# Altium schematic sheet Power_Sheet.SchDoc (part 3 of 3)
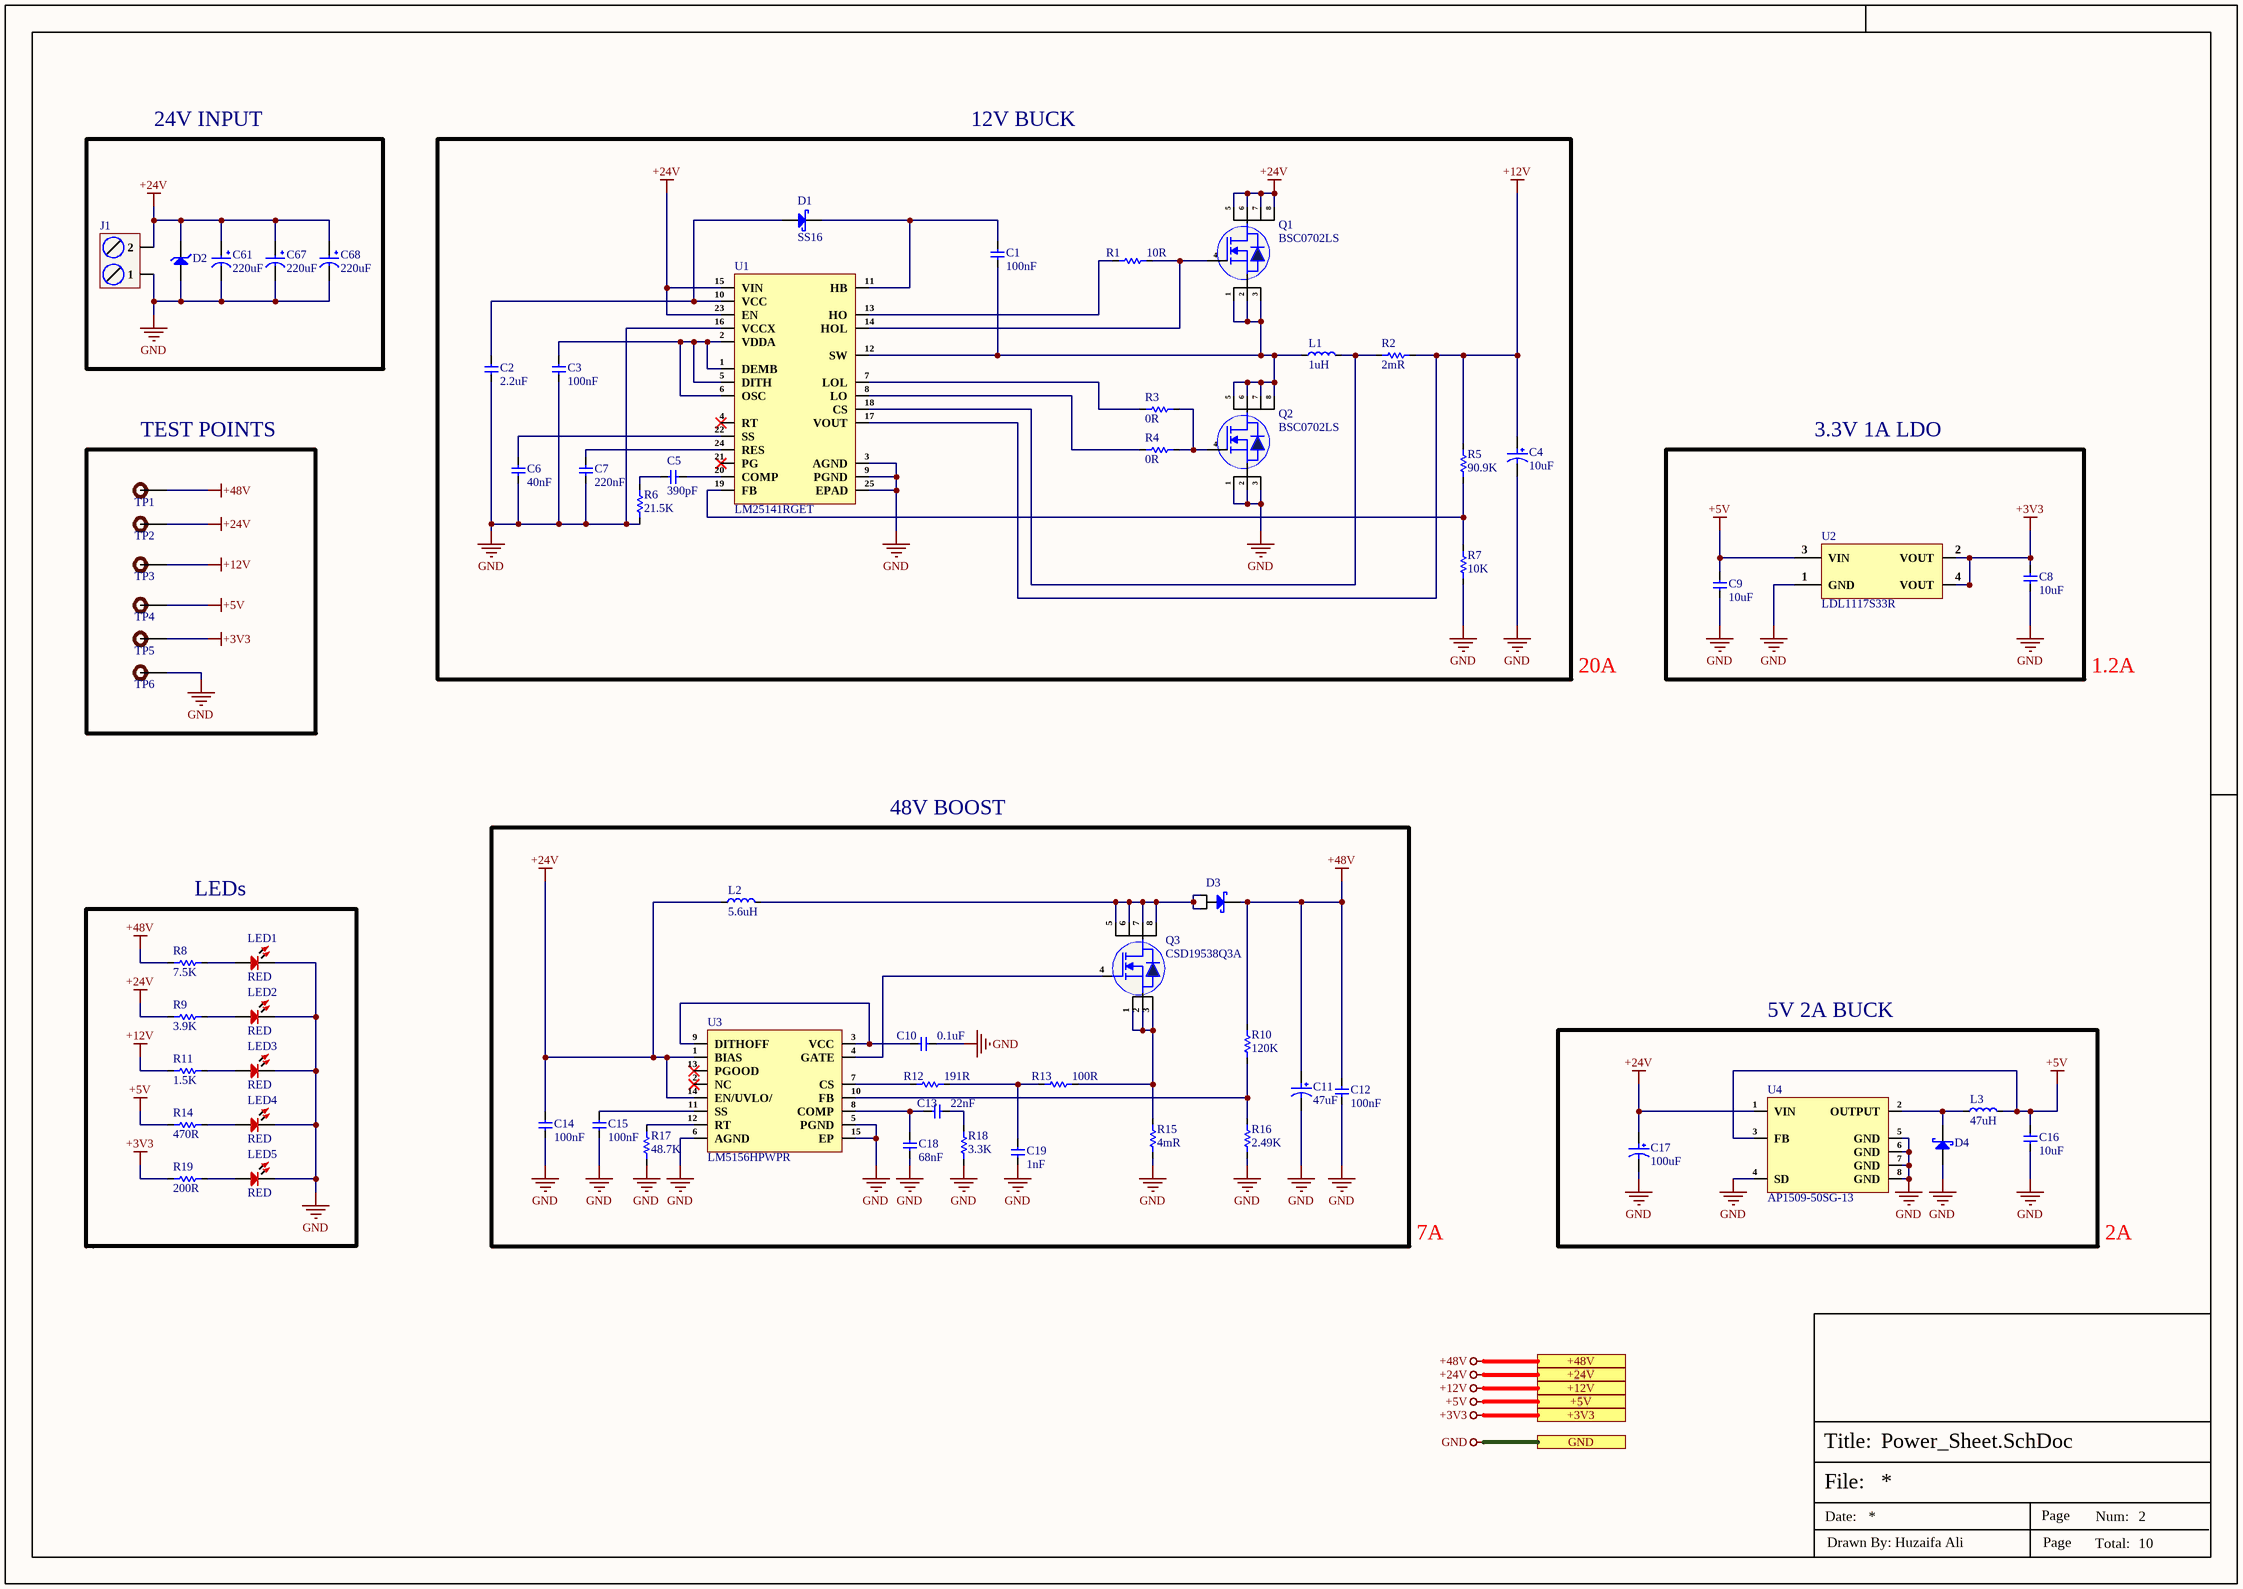
[diagram p2: Power_Sheet.SchDoc]

## Library data of the parts (continued)
R19 = RC0402FR-07200RL: RES 200 OHM 1% 1/16W 0402; Manufacturer: Yageo; Temperature Coefficient: 100ppm/°C; Power Rating: 63mW; Voltage Rating (DC): 50V; Supplier 1: Digi-Key; Manufacturer Part Number: RC0402FR-07200RL; RoHS: Yes; Category: Chip SMD Resistors; Stock 1: 19778; Pricing 1: 1=0.10000, 10=0.01600, 100=0.00660, 1000=0.00299, 2500=0.00259, 5000=0.00214 (USD); Case/Package: 0402; Case Code (Metric): 1005; Case Code (Imperial): 0402; Size Code: 0402; Min Operating Temperature: -55°C; Max Operating Temperature: 155°C; Tolerance: 1%; Resistance: 200R; Resistor Type: Thick Film; Packaging: Tape and Reel; Voltage Rating: 50V; Package Quantity: 1; Number of Terminations: 2; Termination: SMD/SMT; Max Power Dissipation: 63mW; Features: Moisture Resistant; Series: RC; Construction: Rectangular; Resistance Tolerance: 1%; Length: 1mm; Width: 0.02inch; Height: 0.016inch; Depth: 0.5mm; REACH SVHC: No SVHC; Lead Free: Lead Free; RoHS Compliant: Yes; Military Standard: Not; ComponentLink1URL: https://datasheet.ciiva.com/2553/pyu-r-int-thick-7-2553232.pdf?src-supplier=Digi-Key; ComponentLink1Description: https://datasheet.ciiva.com/2553/pyu-r-int-thick-7-2553232.pdf?src-supplier=Digi-Key; ComponentLink2URL: https://datasheet.ciiva.com/7983/1018594-7983509.pdf?src-supplier=Element14; ComponentLink2Description: https://datasheet.ciiva.com/7983/1018594-7983509.pdf?src-supplier=Element14; ComponentLink3URL: https://datasheet.ciiva.com/16804/pyu-rc0402-51-rohs-l-6-r-16804406.pdf?src-supplier=Future+Electronics; ComponentLink3Description: https://datasheet.ciiva.com/16804/pyu-rc0402-51-rohs-l-6-r-16804406.pdf?src-supplier=Future+Electronics; ComponentLink4URL: https://datasheet.ciiva.com/15189/getdatasheetpartid-331152-15189383.pdf?src-supplier=Verical; ComponentLink4Description: https://datasheet.ciiva.com/15189/getdatasheetpartid-331152-15189383.pdf?src-supplier=Verical; ComponentLink5URL: https://datasheet.ciiva.com/7849/1018594-7849898.pdf?src-supplier=Element14; ComponentLink5Description: https://datasheet.ciiva.com/7849/1018594-7849898.pdf?src-supplier=Element14; ComponentLink6URL: https://datasheet.ciiva.com/5562/pyu-rc0402-51-rohs-l-6-r-8721-5562539.pdf?src-supplier=Mouser; ComponentLink6Description: https://datasheet.ciiva.com/5562/pyu-rc0402-51-rohs-l-6-r-8721-5562539.pdf?src-supplier=Mouser; ComponentLink7URL: https://datasheet.ciiva.com/7849/1018594-7849899.pdf?src-supplier=Element14; ComponentLink7Description: https://datasheet.ciiva.com/7849/1018594-7849899.pdf?src-supplier=Element14; ComponentLink8URL: https://datasheet.ciiva.com/2553/pyu-r-int-thick-7-2553230.pdf?src-supplier=Digi-Key; ComponentLink8Description: https://datasheet.ciiva.com/2553/pyu-r-int-thick-7-2553230.pdf?src-supplier=Digi-Key; ComponentLink9URL: https://datasheet.ciiva.com/2553/pyu-r-int-thick-7-2553231.pdf?src-supplier=Digi-Key; ComponentLink9Description: https://datasheet.ciiva.com/2553/pyu-r-int-thick-7-2553231.pdf?src-supplier=Digi-Key; Supplier Part Number 1: 311-200LRCT-ND; LCSC Part Number: C114764
TP1-TP6 = TEST POINT: Test Point ON; Item Type: TEST POINT
U1 = LM25141RGET: LOW VOLTAGE LM5141- SYNC BUCK CO; Manufacturer: Texas Instruments; Item Type: IC; Supplier: Digikey; LCSC Part Number: C2658130; Manufacturer Part Number: LM25141RGET; RoHS: Yes; Stock: 976; Pricing: 1=6.33, 10=5.685, 25=5.3744, 100=4.6579 (USD); ComponentLink1URL: http://www.ti.com/lit/ds/symlink/lm25141.pdf?src-supplier=Farnell; ComponentLink1Description: http://www.ti.com/lit/ds/symlink/lm25141.pdf?src-supplier=Farnell; ComponentLink2URL: http://www.ti.com/general/docs/suppproductinfo.tsp?distId=10&gotoUrl=http%3A%2F%2Fwww.ti.com%2Flit%2Fgpn%2Flm25141&src-supplier=Digikey; ComponentLink2Description: http://www.ti.com/general/docs/suppproductinfo.tsp?distId=10&gotoUrl=http%3A%2F%2Fwww.ti.com%2Flit%2Fgpn%2Flm25141&src-supplier=Digikey
U2 = LDL1117S33R: IC REG LINEAR 3.3V 1.2A SOT223; Manufacturer: STMicroelectronics; Output Type: Fixed; Output Configuration: Positive; Number of Regulators: 1; Max Input Voltage: 18V; Dropout Voltage: 600mV; Quiescent Current: 500uA; Power Supply Rejection Ratio (PSRR): 65dB; Supplier 1: Digi-Key; Manufacturer Part Number: LDL1117S33R; Stock 1: 13064; Pricing 1: 1=0.45, 10=0.362, 100=0.2465, 500=0.1849, 1000=0.13867 (USD); Mount: Surface Mount; Case/Package: TO-261-4; Min Operating Temperature: -40°C; Max Operating Temperature: 125°C; Packaging: Tape and Reel; Min Output Voltage: 3.3V; Output Current: 1.2A; Supplier Part Number 1: 497-17239-6-ND; ComponentLink1Description: LCSC; ComponentLink1URL: https://www.lcsc.com/product-detail/Linear-Voltage-Regulators-LDO_STMicroelectronics-LDL1117S33R_C435835.html; LCSC Part Number: C435835; Item Type: IC
U3 = LM5156HPWPR: 2.2MHZ WIDE INPUT NONSYNCHRONOUS; Manufacturer: Texas Instruments; Item Type: IC; Supplier: Digikey; LCSC Part Number: C2867852; Manufacturer Part Number: LM5156HPWPR; RoHS: No; Stock: 2799; Pricing: 1=2.18, 10=1.954, 25=1.8432, 100=1.5704, 250=1.4746, 500=1.29028, 1000=1.06908 (USD)
U4 = AP1509-50SG-13: IC REG BUCK 5V 2A 8SOP; Manufacturer: Diodes; Number of Outputs: 1; Min Input Voltage: 4.5V; Max Supply Voltage: 22V; Efficiency: 83%; Switching Frequency: 150kHz; Synchronous Rectifier: No; Operating Supply Current: 5mA; Output Type: Fixed; Output Configuration: Positive; Frequency: 173kHz; Supplier 1: Rs; Manufacturer Part Number: AP1509-50SG-13; RoHS: Yes; Category: Voltage Regulators - Switching; Stock 1: 2230; Pricing 1: 25=1.20600, 125=0.91800, 625=0.81800, 1250=0.63800 (GBP); Mounting Technology: Surface Mount; Case/Package: SOP; Pins: 8; Weight: 0.030018oz; Contact Plating: Tin,Matte; Min Operating Temperature: -20°C; Max Operating Temperature: 85°C; Packaging: Tape and Reel; Output Voltage: 5V; Max Output current: 2A; Package Quantity: 2500; Output Current: 2A; Min Supply Voltage: 4.5V; Nominal Output Voltage: 5V; Min Output Voltage: 5V; Max Output Voltage: 5V; Operating Supply Voltage: 22V; Series: -; Length: 4.95mm; Width: 3.95mm; Height: 1.5mm; Reach SVHC Compliant: Yes; Lead Free: Lead Free; RoHS Compliant: Yes; ComponentLink1URL: https://datasheet.ciiva.com/1161/608784-1161660.pdf?src-supplier=Element14; ComponentLink1Description: https://datasheet.ciiva.com/1161/608784-1161660.pdf?src-supplier=Element14; Supplier Part Number 1: 7512923P; LCSC Part Number: C9984; Item Type: IC